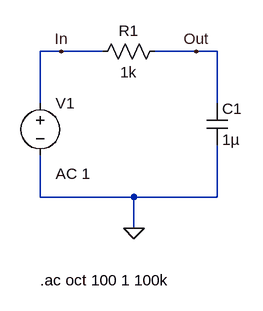
[diagram p0: schematic Single Pole RC Low-pass Filter.asc]
Single Pole RC Low-pass Filter.asc, the LTspice schematic file:
Version 4
SHEET 1 880 680
WIRE -256 16 -288 16
WIRE -192 16 -256 16
WIRE -48 16 -112 16
WIRE -16 16 -48 16
WIRE -288 96 -288 16
WIRE -16 96 -16 16
WIRE -288 240 -288 176
WIRE -144 240 -288 240
WIRE -16 240 -16 160
WIRE -16 240 -144 240
WIRE -144 288 -144 240
FLAG -144 288 0
FLAG -48 16 Out
FLAG -256 16 In
SYMBOL voltage -288 80 R0
WINDOW 123 24 124 Left 2
WINDOW 39 0 0 Left 2
SYMATTR Value2 AC 1
SYMATTR InstName V1
SYMATTR Value ""
SYMBOL res -96 0 R90
WINDOW 0 0 56 VBottom 2
WINDOW 3 32 56 VTop 2
SYMATTR InstName R1
SYMATTR Value 1k
SYMBOL cap -32 96 R0
SYMATTR InstName C1
SYMATTR Value 1µ
TEXT -288 368 Left 2 !.ac oct 100 1 100k

The netlist it stands for:
* Single Pole RC Low-pass Filter.asc
V1 In 0 AC 1
R1 Out In 1k
C1 Out 0 1µ
.ac oct 100 1 100k
.backanno
.end